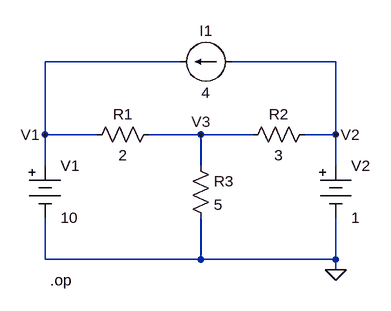
[diagram p0: schematic g3_p8.asc]
g3_p8.asc, the LTspice schematic file:
Version 4
SHEET 1 880 680
WIRE 112 32 -96 32
WIRE 352 32 192 32
WIRE -96 144 -96 32
WIRE -16 144 -96 144
WIRE 144 144 64 144
WIRE 224 144 144 144
WIRE 352 144 352 32
WIRE 352 144 304 144
WIRE -96 192 -96 144
WIRE 144 192 144 144
WIRE 352 192 352 144
WIRE -96 336 -96 272
WIRE 144 336 144 272
WIRE 144 336 -96 336
WIRE 352 336 352 272
WIRE 352 336 144 336
WIRE 352 352 352 336
FLAG -96 144 V1
FLAG 352 144 V2
FLAG 144 144 V3
FLAG 352 352 0
SYMBOL res -32 160 R270
WINDOW 0 32 56 VTop 2
WINDOW 3 0 56 VBottom 2
SYMATTR InstName R1
SYMATTR Value 2
SYMBOL res 208 160 R270
WINDOW 0 32 56 VTop 2
WINDOW 3 0 56 VBottom 2
SYMATTR InstName R2
SYMATTR Value 3
SYMBOL res 128 176 R0
SYMATTR InstName R3
SYMATTR Value 5
SYMBOL Misc\\battery -96 176 R0
SYMATTR InstName V1
SYMATTR Value 10
SYMBOL Misc\\battery 352 176 R0
SYMATTR InstName V2
SYMATTR Value 1
SYMBOL current 192 32 R90
WINDOW 0 -32 40 VBottom 2
WINDOW 3 32 40 VTop 2
SYMATTR InstName I1
SYMATTR Value 4
TEXT -88 368 Left 2 !.op

The netlist it stands for:
* g3_p8.asc
R1 V1 V3 2
R2 V3 V2 3
R3 V3 0 5
V1 V1 0 10
V2 V2 0 1
I1 V2 V1 4
.op
.backanno
.end